# Altium schematic sheet Cover Page.SchDoc
size 420 x 297 mm; Date: 22.03.2024; ApprovedBy: Arda B.; CheckedBy: Arda B.; DrawnBy: Arda Bozkurt; Revision: 001; SheetNumber: 1; SheetTotal: 9; Size: A3; Department: HDD; DOC_NO_ASSY_: __; Time: 22.03.2024
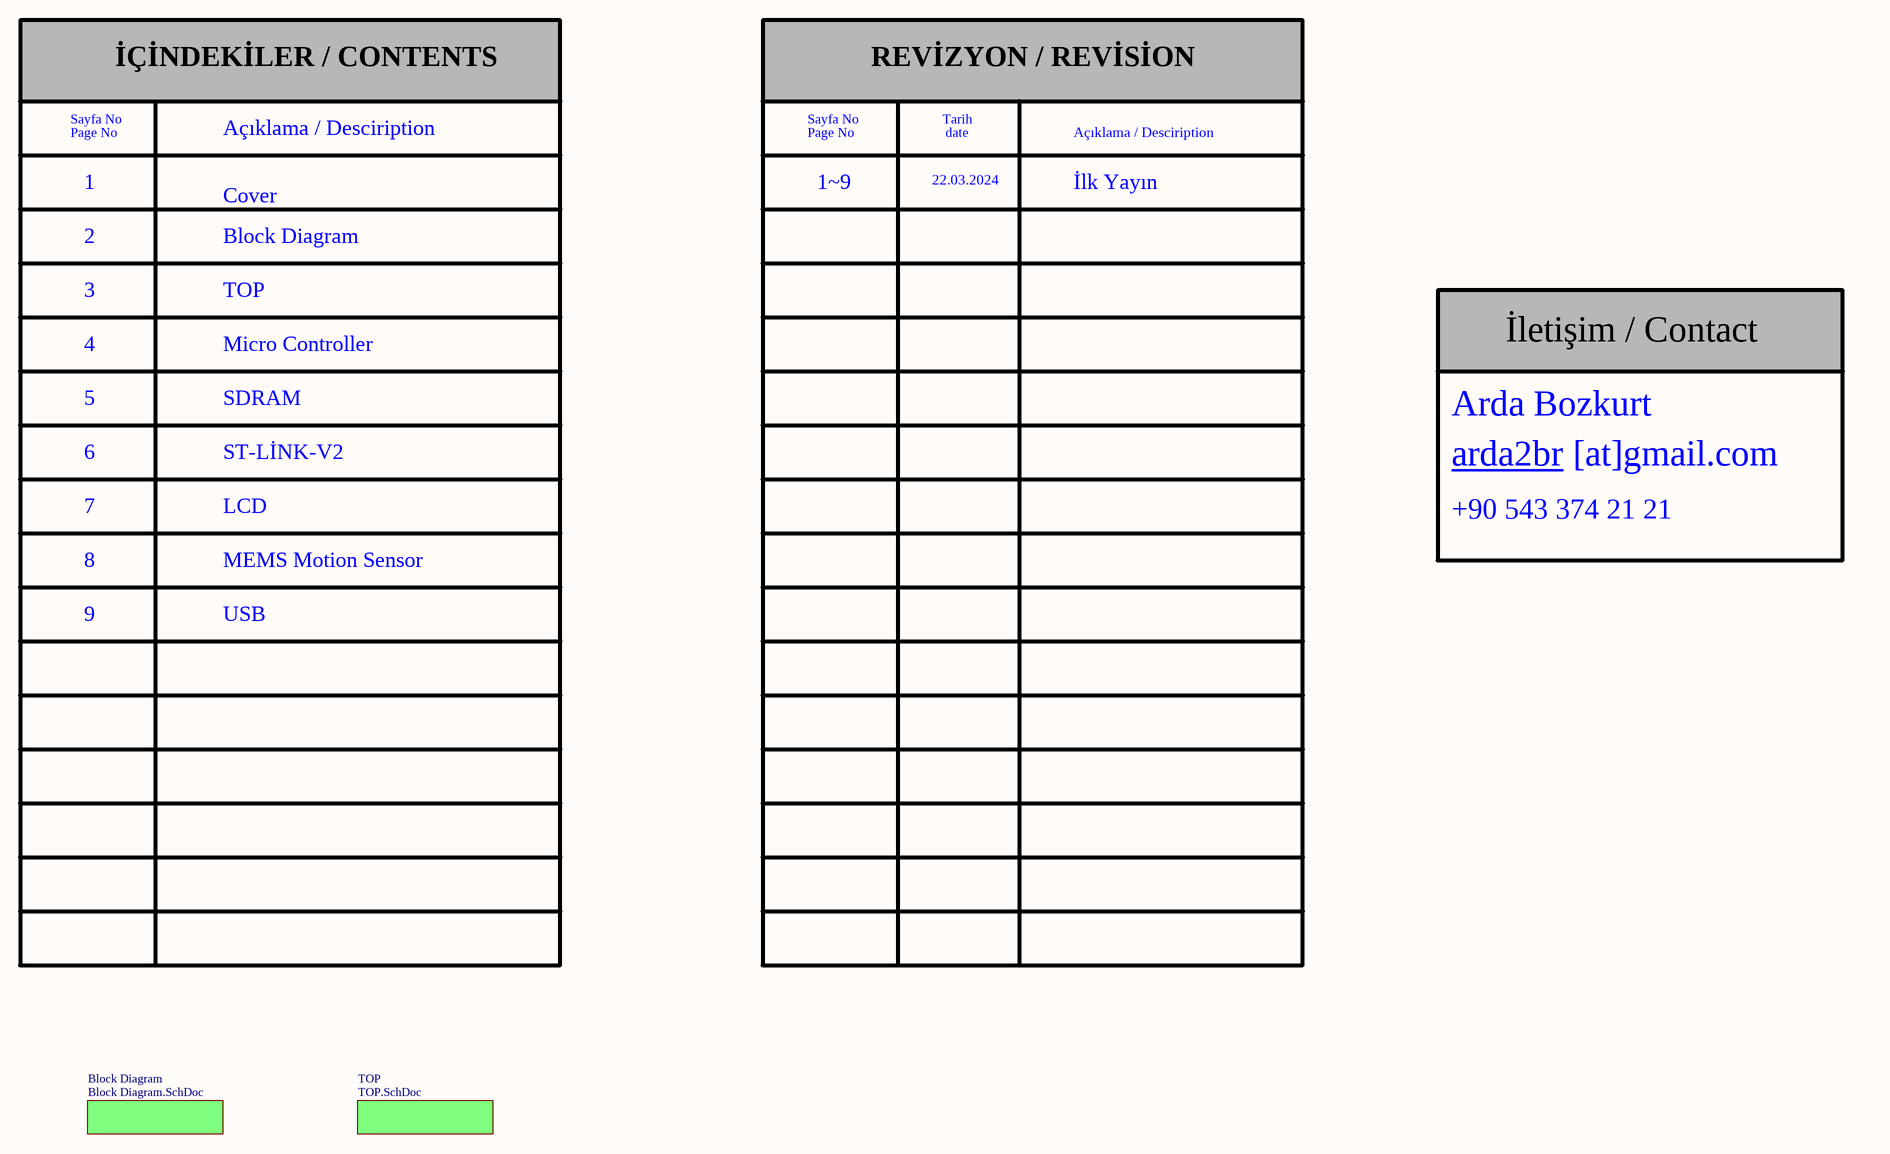
[diagram p0: Cover Page.SchDoc]

## Sub-sheets
Block Diagram = Block Diagram.SchDoc: no entries
TOP = TOP.SchDoc: no entries

## Notes on the sheet
- İÇİNDEKİLER / CONTENTS
- REVİZYON / REVİSİON
- Page No
- Sayfa No
- Açıklama / Desciription
- 22.03.2024
- Tarih
- date
- 1
- 2
- Cover
- Block Diagram
- 1~9
- İlk Yayın
- 3
- TOP
- 4
- Micro Controller
- İletişim / Contact
- 5
- SDRAM
- Arda Bozkurt
- 6
- 7
- ST-LİNK-V2
- LCD
- arda2br
- [at]gmail.com
- 8
- MEMS Motion Sensor
- +90 543 374 21 21
- 9
- USB
- REVİSİON
- DESCRIPTION
- DATE
- APPROVED
- DWG NO:
- TAINIM/DESCRIPTION
- REV:
- DOSYA ADI/FİLE NAME
- HAZIRLAYAN/PREPARED BY
- KONTROL EDEN/ CHECKED BY
- YAYIN TARİHİ/REL. DATE
- DEĞ TARİHİ/CHANCE DATE
- ONAYLAYAN/APPROVED BY
- REVİZYON/REVISION
- BÖLÜM/DEPARTMENT
- BOYUT/SİZE
- SAYFA/SHEET
- of